# EAGLE design board_ders (EAGLE 9.2.2)
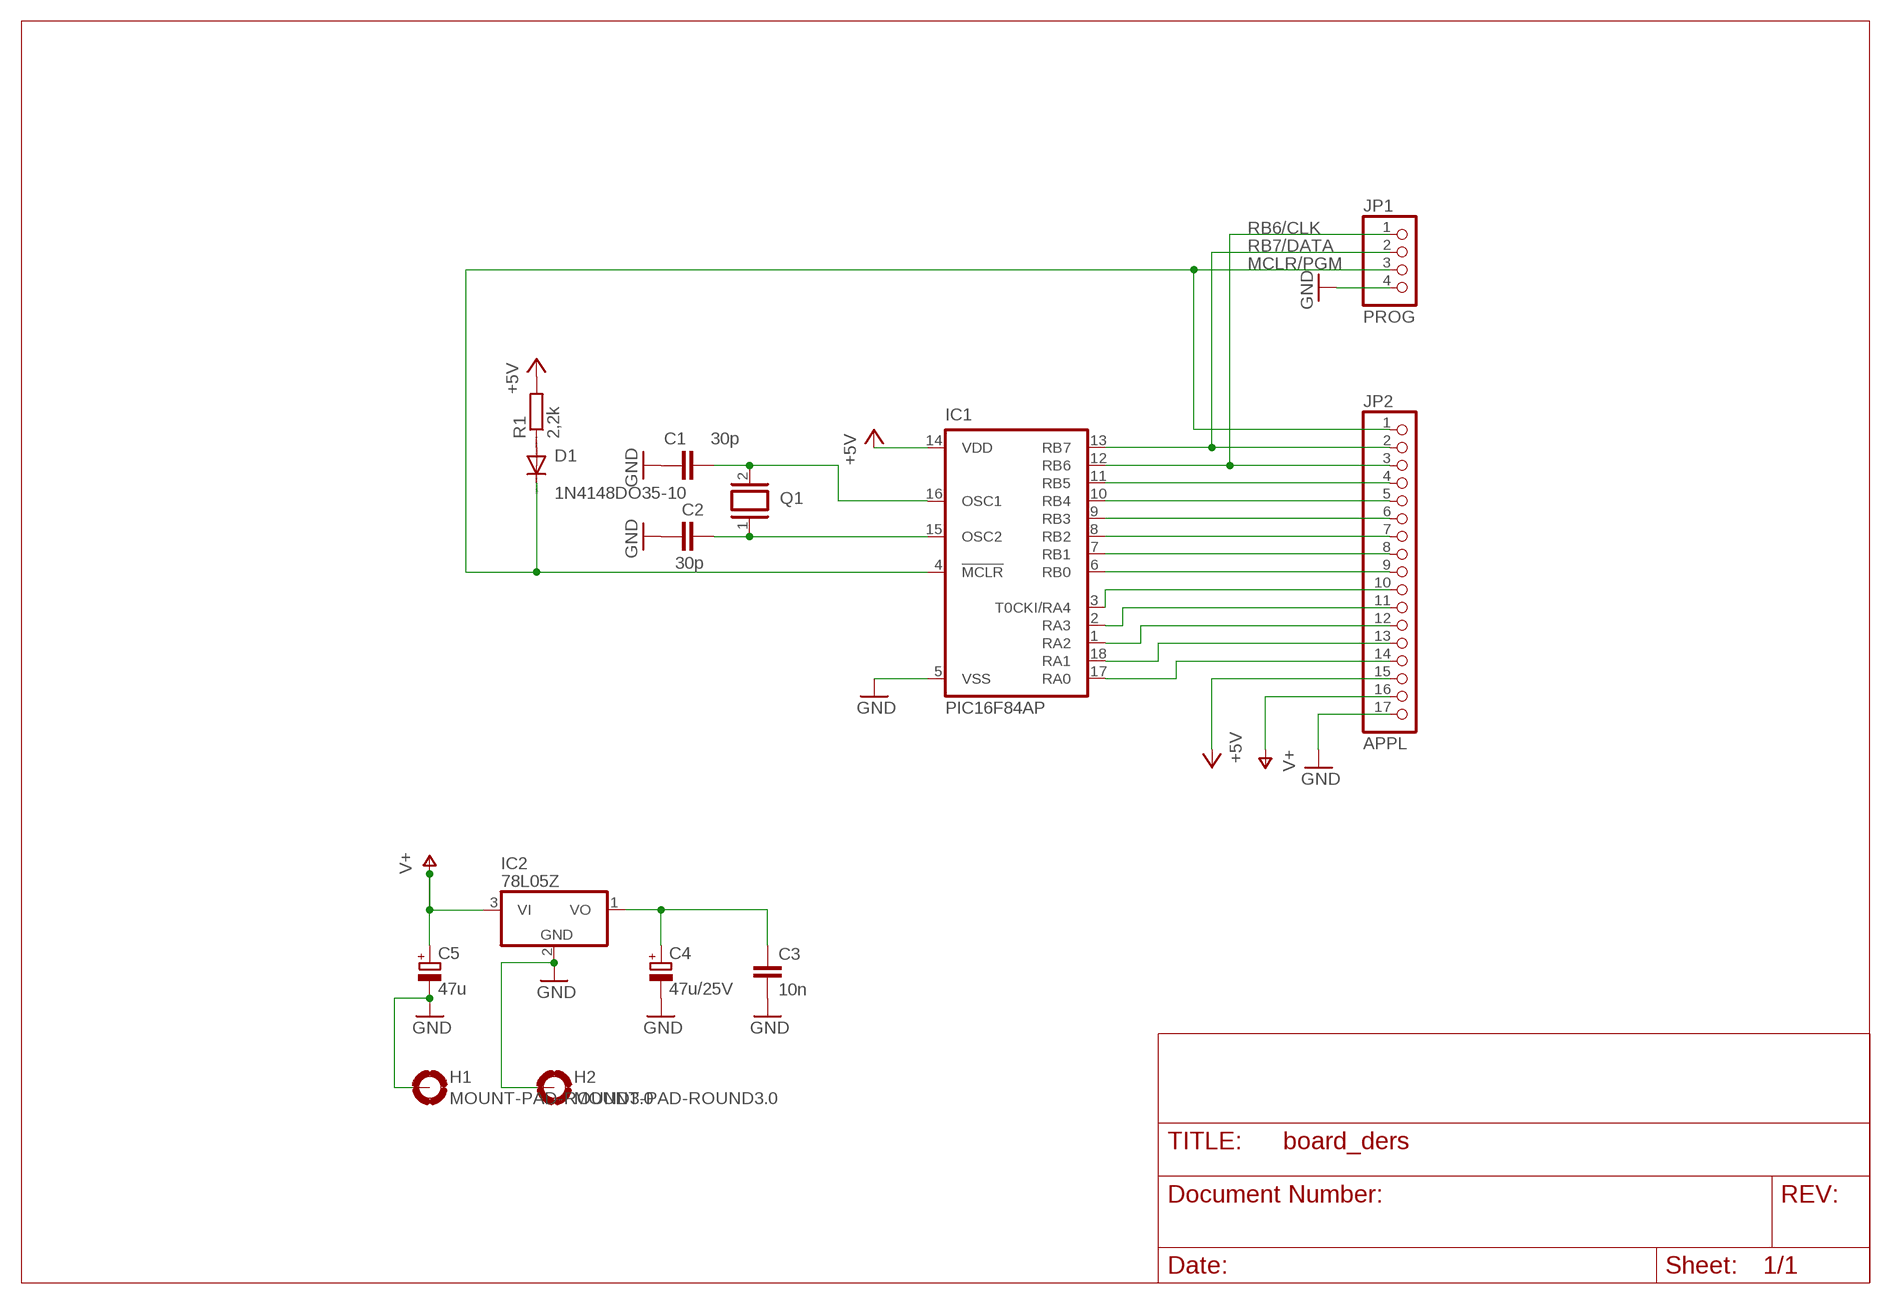
[diagram p0: schematic, sheet 1]

## Parts
C1  30p  C-EUC1206  [C1206]
C2  30p  C-EUC1206  [C1206]
C3  10n  C-EU025-025X050  [C025-025X050]
C4  47u/25V  CPOL-EUTAP5-45  [TAP5-45]
C5  47u  CPOL-EUTAP5-45  [TAP5-45]
D1  1N4148DO35-10  [DO35-10]
H1  MOUNT-PAD-ROUND3.0  [3,0-PAD]
H2  MOUNT-PAD-ROUND3.0  [3,0-PAD]
IC1  PIC16F84AP  [DIL18]
IC2  78L05Z  [TO92]
JP1  PROG  PINHD-1X4  [1X04]
JP2  APPL  PINHD-1X17  [1X17]
Q1  XTAL/S  [QS]
R1  2,2k  R-EU_R1206  [R1206]

## Nets
+5V [power]: IC1.14(VDD) JP2.15 R1.2
GND [power]: C1.1 C2.1 C3.2 C4.- C5.- H1.B3,0(MOUNT) H2.B3,0(MOUNT) IC1.5(VSS) IC2.2(GND) JP1.4 JP2.17
MCLR/PGM: D1.C IC1.4(!MCLR) JP1.3 JP2.1
N$1: C3.1 C4.+ IC2.1(VO)
N$2: C1.2 IC1.16(OSC1) Q1.2
N$3: C2.2 IC1.15(OSC2) Q1.1
N$4: D1.A R1.1
RA0: IC1.17(RA0) JP2.14
RA1: IC1.18(RA1) JP2.13
RA2: IC1.1(RA2) JP2.12
RA3: IC1.2(RA3) JP2.11
RA4: IC1.3(T0CKI/RA4) JP2.10
RB0: IC1.6(RB0) JP2.9
RB1: IC1.7(RB1) JP2.8
RB2: IC1.8(RB2) JP2.7
RB3: IC1.9(RB3) JP2.6
RB4: IC1.10(RB4) JP2.5
RB5: IC1.11(RB5) JP2.4
RB6/CLK: IC1.12(RB6) JP1.1 JP2.3
RB7/DATA: IC1.13(RB7) JP1.2 JP2.2
V+ [power]: C5.+ IC2.3(VI) JP2.16

## Library data of the parts
C1-C3 = rcl:C-EU: CAPACITOR, European symbol
C4 C5 = rcl:CPOL-EU: POLARIZED CAPACITOR, European symbol
D1 = diode:1N4148: DIODE high speed (Philips)
H1 H2 = holes:MOUNT-PAD-ROUND: MOUNTING PAD, round
IC1 = microchip:PIC16F8*: MICROCONTROLLER 8-Bit PIC16F8X Family - CMOS Flash/EEPROM Pin Compatible : PIC16F83, PIC16CR83, PIC16F84A, PIC16CR84 see also PIC16C* <DEVICE:PIC16C*>; MF: MICROCHIP; MPN: PIC16F84A-04I/P; OC_FARNELL: 9760865; OC_NEWARK: 69K7635
IC2 = linear:78*: Positive VOLTAGE REGULATOR Source: http://cache.national.com/ds/LM/LM78L05.pdf http://www.fairchildsemi.com/ds/LM/LM7805.pdf
JP1 = pinhead:PINHD-1X4: PIN HEADER
JP2 = pinhead:PINHD-1X17: PIN HEADER
Q1 = special:XTAL/S: CRYSTAL
R1 = rcl:R-EU_: RESISTOR, European symbol

## Net classes
0 default: width 0.3 mm, drill 0.6 mm, clearance 0.2 mm
1 power: width 0.4 mm, drill 0.6 mm, clearance 0.2 mm

## Board
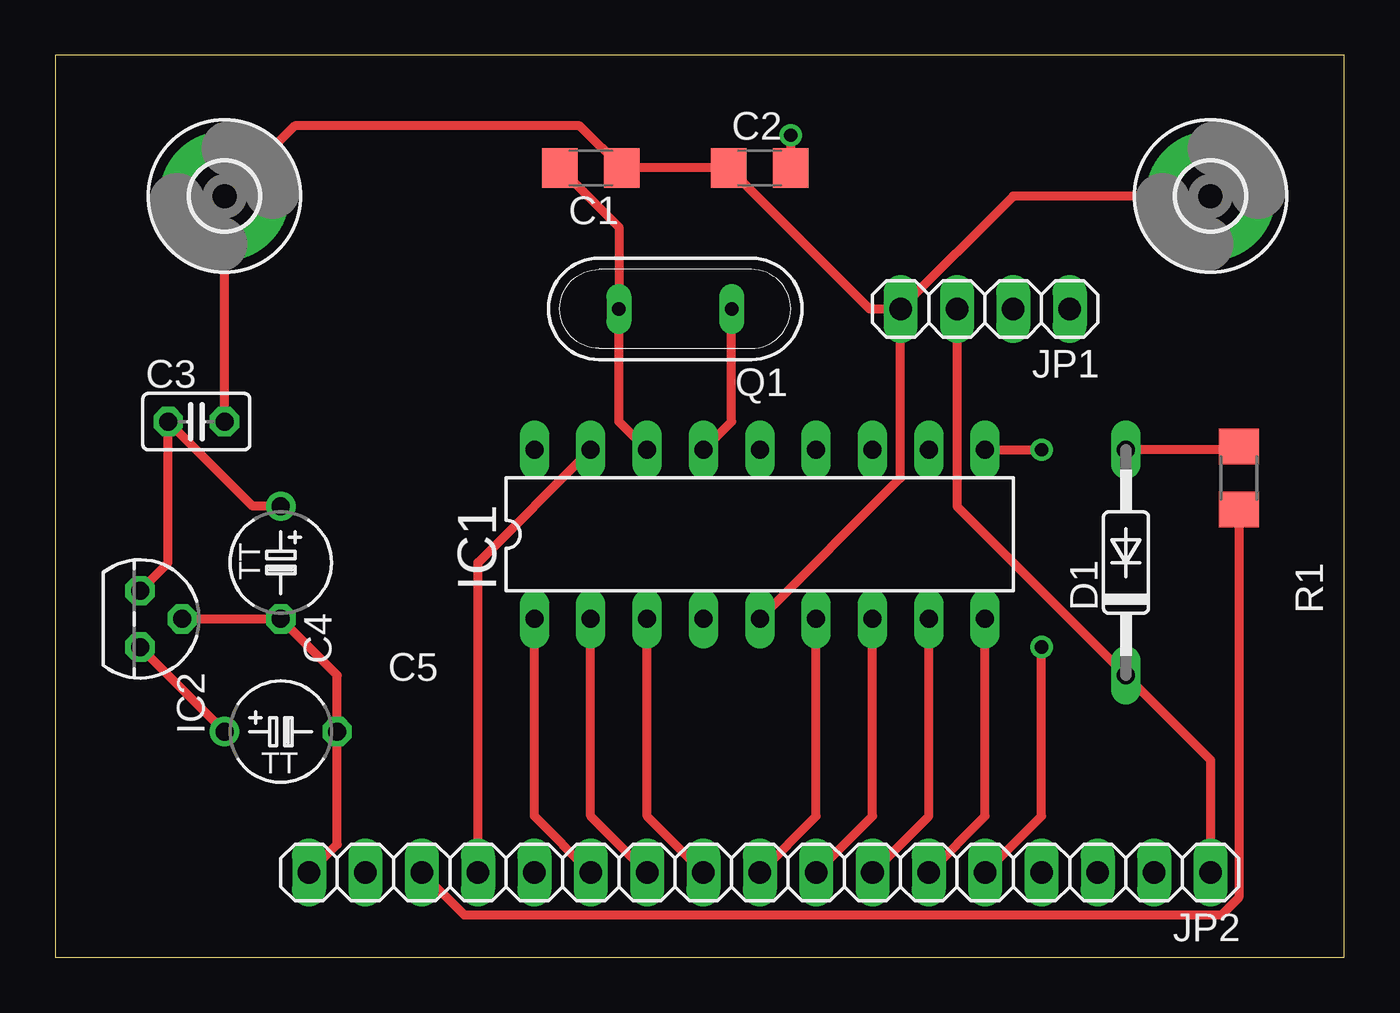
[diagram p1: board, top side]
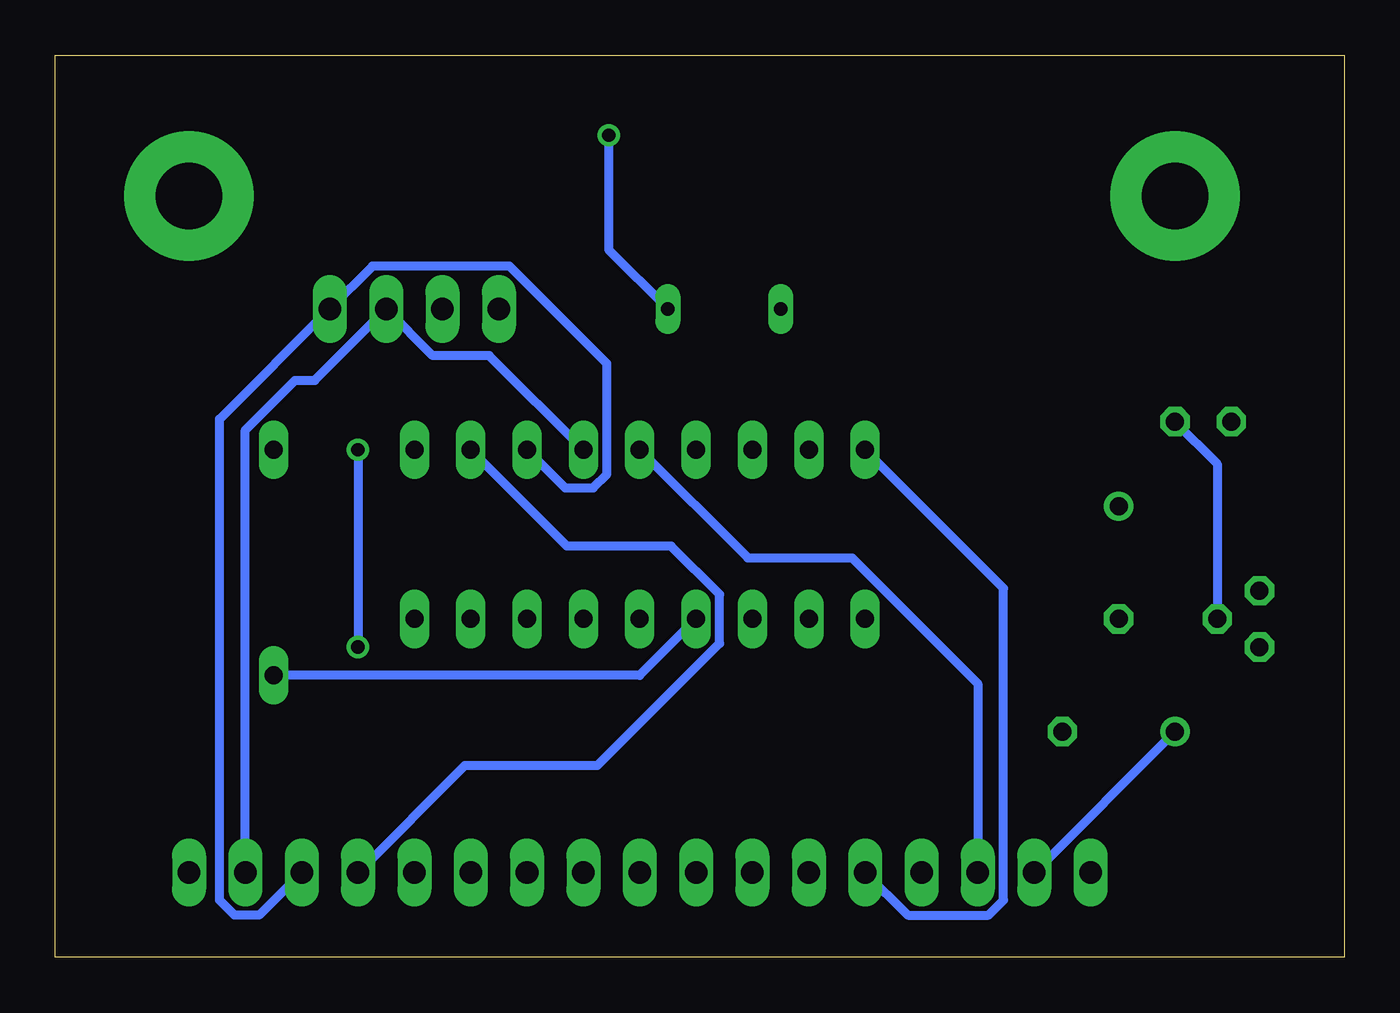
[diagram p2: board, bottom side, seen from below]

Size 58.09 x 40.63 mm. Coordinates in mm from the lower left corner, seen from the top.
Outline: 0,0 58.09,0 58.09,40.63 0,40.63 0,0
Copper layers (1*16): Top 0.035mm / dielectric 1.5mm / Bottom 0.035mm
Design rules "default": minimum track width 6mil, minimum drill 0.35mm, track to track 6mil, track to pad 6mil, pad to pad 6mil, via to via 6mil, smd to smd 6mil, copper to edge 40mil, drill to drill 6mil, minimum pad ring 10mil, minimum via ring 8mil, stop-mask expansion 4mil, vias tented up to drill 0mil, thermal gap 10mil

### Footprints (pad centres in the part's own frame; a part is rotated, then mirrored left to right if it is on the bottom)
C1206 = smd 1.6 x 1.8: 1 -1.4,0; 2 1.4,0
C025-025X050 = drill 0.813 octagon: 1 -1.27,0; 2 1.27,0
TAP5-45 = drill 0.813: + -2.54,0 | drill 0.813 octagon: - 2.54,0
DO35-10 = drill 0.813 long: A 5.08,0; C -5.08,0
3,0-PAD = drill 3 pad 5.842: B3,0 0,0
DIL18 = drill 0.813 long: 1 -10.16,-3.81; 2 -7.62,-3.81; 3 -5.08,-3.81; 4 -2.54,-3.81; 5 0,-3.81; 6 2.54,-3.81; 7 5.08,-3.81; 8 7.62,-3.81; 9 10.16,-3.81; 10 10.16,3.81; 11 7.62,3.81; 12 5.08,3.81; 13 2.54,3.81; 14 0,3.81; 15 -2.54,3.81; 16 -5.08,3.81; 17 -7.62,3.81; 18 -10.16,3.81
TO92 = drill 0.813 octagon: 1 -1.27,0; 2 0,1.905; 3 1.27,0
1X04 = drill 1.016 long: 1 -3.81,0; 2 -1.27,0; 3 1.27,0; 4 3.81,0
1X17 = drill 1.016 long: 1 -20.32,0; 2 -17.78,0; 3 -15.24,0; 4 -12.7,0; 5 -10.16,0; 6 -7.62,0; 7 -5.08,0; 8 -2.54,0; 9 0,0; 10 2.54,0; 11 5.08,0; 12 7.62,0; 13 10.16,0; 14 12.7,0; 15 15.24,0; 16 17.78,0; 17 20.32,0
QS = drill 0.61 long: 1 -2.54,0; 2 2.54,0
R1206 = smd 1.6 x 1.803: 1 -1.422,0; 2 1.422,0

### Placement (x,y rotation side)
C1  24.13,35.56 180 top
C2  31.75,35.56 0 top
C3  6.35,24.13 0 top
C4  10.16,17.78 270 top
C5  10.16,10.16 0 top
D1  48.26,17.78 90 top
H1  7.62,34.29 180 top
H2  52.07,34.29 0 top
IC1  31.75,19.05 0 top
IC2  3.81,15.24 270 top
JP1  41.91,29.21 180 top
JP2  31.75,3.81 180 top
Q1  27.94,29.21 180 top
R1  53.34,21.59 270 top

### Tracks (layer width: path | path; a pad name or v marks a point on that pad's centre or on a via)
+5V
  Top 0.4: R1.2 53.34,2.67 52.55,1.89 18.43,1.89 JP2.15
  Bottom 0.4: IC1.14 26.88,17.99 22.18,17.99 16.51,12.32 JP2.15
GND
  Top 0.4: H2.B3,0 43.18,34.29 JP1.4 | JP1.4 36.7,29.21 C2.1 C1.1 23.63,37.46 10.79,37.46 H1.B3,0 C3.2 | JP2.17 12.7,5.08 C5.- 12.7,12.7 C4.- IC2.2 | IC1.5 38.1,21.59 JP1.4
  Bottom 0.4: C3.2 5.71,22.23 IC2.2
MCLR/PGM
  Top 0.4: JP1.3 40.64,20.32 D1.C 52.07,8.89 JP2.1
  Bottom 0.4: IC1.4 31.75,12.7 D1.C
N$1
  Top 0.4: C4.+ 8.89,20.32 C3.1 5.08,17.78 IC2.1
N$2
  Top 0.4: IC1.16 25.4,24.13 Q1.2 25.4,32.89 C1.2
N$3  (via drill 0.6)
  Top 0.4: IC1.15 30.48,24.13 Q1.1 | C2.2 v33.15,37.04
  Bottom 0.4: v33.15,37.04 33.15,31.88 Q1.1
N$4
  Top 0.4: R1.1 53.19,22.86 D1.A
RA0
  Top 0.4: JP2.14 19.05,17.78 IC1.17
RA1
  Bottom 0.4: JP2.13 19.67,1.89 16.03,1.89 15.35,2.57 15.35,16.62 IC1.18
RA2
  Top 0.4: JP2.12 21.59,6.35 IC1.1
RA3
  Top 0.4: JP2.11 24.13,6.35 IC1.2
RA4
  Top 0.4: JP2.10 26.67,6.35 IC1.3
RB0
  Top 0.4: JP2.9 34.29,6.35 IC1.6
RB1
  Top 0.4: JP2.8 36.83,6.35 IC1.7
RB2
  Top 0.4: JP2.7 39.37,6.35 IC1.8
RB3
  Top 0.4: JP2.6 41.91,6.35 IC1.9
RB4  (via drill 0.6)
  Top 0.4: IC1.10 v44.45,22.86 | JP2.5 44.45,6.35 v44.45,13.97
  Bottom 0.4: v44.45,22.86 v44.45,13.97
RB5
  Bottom 0.4: JP2.4 39.62,8.64 33.65,8.64 28.15,14.14 28.15,16.34 30.33,18.52 35.03,18.52 IC1.11
RB6/CLK
  Bottom 0.4: JP2.3 48.91,1.89 50.01,1.89 50.69,2.57 50.69,24.24 JP1.1 43.8,31.13 37.62,31.13 33.23,26.75 33.23,21.76 33.85,21.14 35.11,21.14 IC1.12
RB7/DATA
  Bottom 0.4: IC1.13 38.54,27.11 41.08,27.11 JP1.2 46.41,25.98 47.3,25.98 49.53,23.75 JP2.2
V+
  Top 0.4: C5.+ IC2.3
  Bottom 0.4: JP2.16 C5.+